# Altium schematic sheet Sheet1.SchDoc
size A0
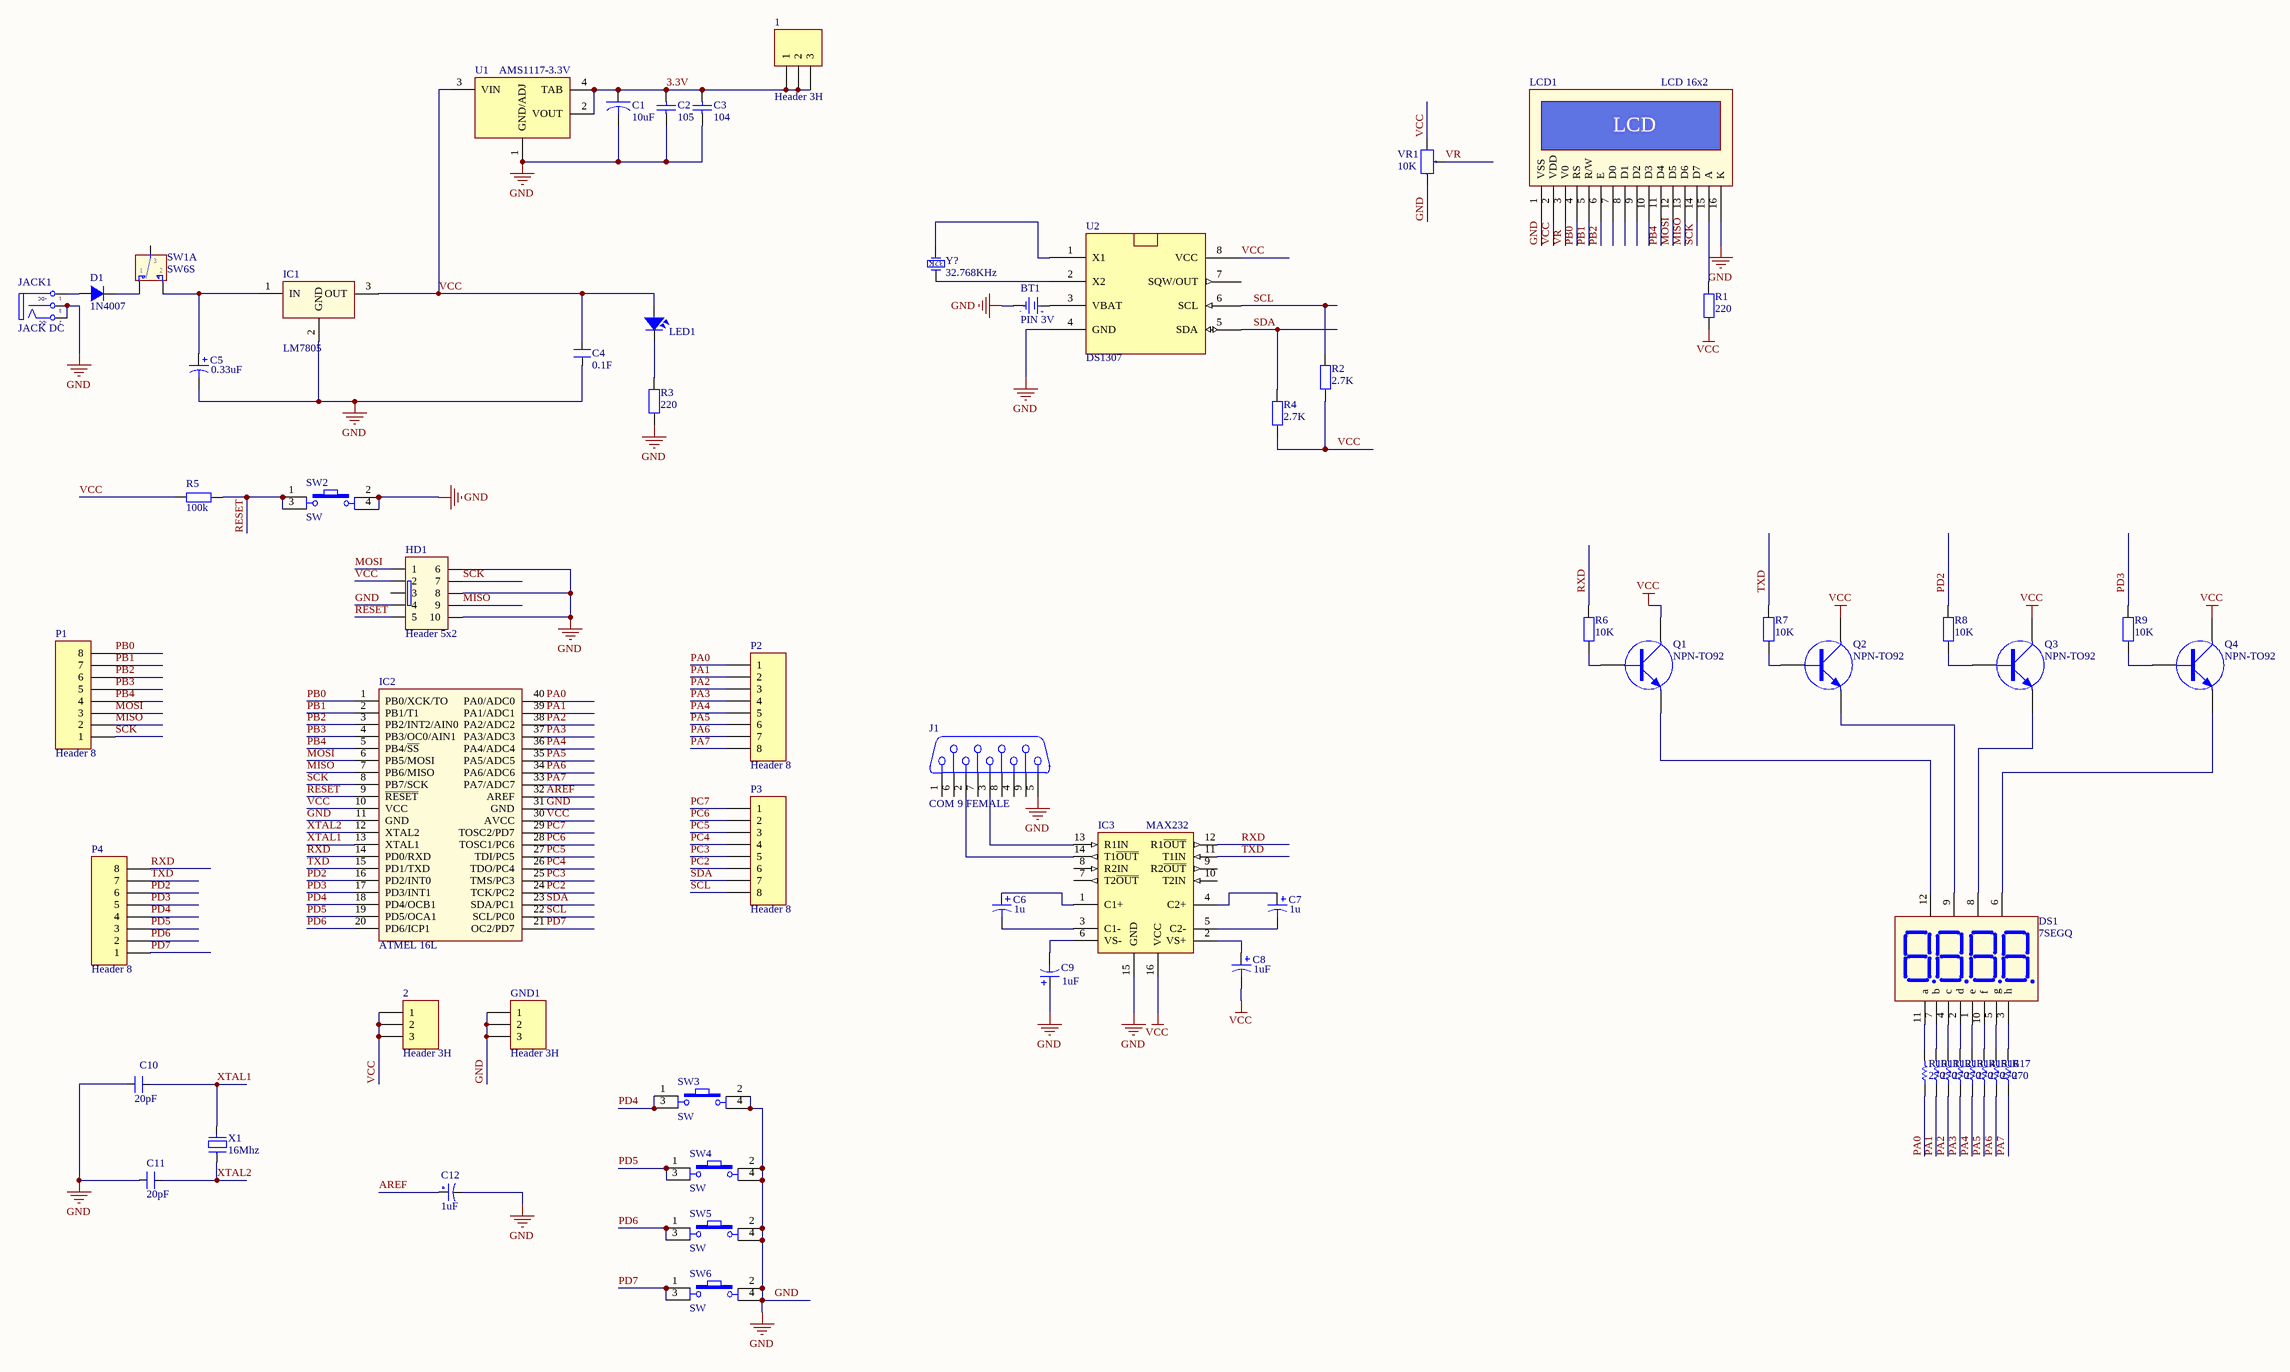
[diagram p0: Sheet1.SchDoc]

## Parts
1  Header 3H  [HDR1X3]
2  Header 3H  [HDR1X3]
BT1  PIN 3V  [PIN3V]
C1  10uF  [CAP RADIAL 3.5x7.7]
C2  105  [CAP 10x DIP]
C3  104  [CAP 10x DIP]
C4  0.1F  [CN3]
C5  value 0.33uF  [CAP RADIAL 3.5x7.7]
C6  value 1u  [CAP RADIAL 3.5x7.7]
C7  value 1u  [CAP RADIAL 3.5x7.7]
C8  value 1uF  [CAP RADIAL 3.5x7.7]
C9  value 1uF  [CAP RADIAL 3.5x7.7]
C10  20pF  [CN1]
C11  20pF  [CN1]
C12  1uF  [CP1/2]
D1  1N4007  [D1A]
DS1  7SEGQ  [7SEGQ]
GND1  Header 3H  [HDR1X3]
HD1  Header 5x2  [Hed2X5]
IC1  LM7805  [QTO-220H3]
IC2  ATMEL 16L  [DIP40/W0.6]
IC3  MAX232  [DIP16/W0.3]
J1  COM 9 FEMALE  [COM9 FEMALE]
JACK1  JACK DC  [JACK DC]
LCD1  LCD 16x2  [LCD 16x2-A]
LED1  LED  [LED-5-Green]  (value not drawn)
P1  Header 8  [HDR1X8]
P2  Header 8  [HDR1X8]
P3  Header 8  [HDR1X8]
P4  Header 8  [HDR1X8]
Q1  NPN-TO92  [TO-92]
Q2  NPN-TO92  [TO-92]
Q3  NPN-TO92  [TO-92]
Q4  NPN-TO92  [TO-92]
R1  220  [R1/4W]
R2  2.7K  [R1/4W]
R3  220  [R1/4W]
R4  2.7K  [R1/4W]
R5  100k  [RESISTOR]
R6  10K  [R1/4W]
R7  10K  [R1/4W]
R8  10K  [R1/4W]
R9  10K  [R1/4W]
R10  value 270  [R1/4W1]  (hidden comment: Res1)
R11  value 270  [R1/4W1]  (hidden comment: Res1)
R12  value 270  [R1/4W1]  (hidden comment: Res1)
R13  value 270  [R1/4W1]  (hidden comment: Res1)
R14  value 270  [R1/4W1]  (hidden comment: Res1)
R15  value 270  [R1/4W1]  (hidden comment: Res1)
R16  value 270  [R1/4W1]  (hidden comment: Res1)
R17  value 270  [R1/4W1]  (hidden comment: Res1)
SW1  SW6S  [SW6]  (part A of 2)
SW2  SW  [SW4]
SW3  SW  [SW4]
SW4  SW  [SW4]
SW5  SW  [SW4]
SW6  SW  [SW4]
U1  AMS1117-3.3V  [SOT223 - 3 LEAD]
U2  DS1307  [DIP8/W0.3]
VR1  10K  [VR]
X1  16Mhz  [XT2]
Y?  32.768KHz  [XTAL32K]

## Nets
GND: BT1.2(GND) C1.2 C2.1 C3.1 C4.2 C5.2 C9.1 C10.2 C11.2 C12.2 GND1.1 GND1.2 GND1.3 HD1.4 HD1.6 HD1.8 HD1.10 IC1.2(GND) IC2.11(GND) IC2.31(GND) IC3.15(GND) J1.5 JACK1.2(TN) JACK1.3(S) LCD1.1(VSS) LCD1.16(K) R3.1 SW2.2 SW2.4 SW3.2 SW3.4 SW4.2 SW4.4 SW5.2 SW5.4 SW6.2 SW6.4 U1.1(GND/ADJ) U2.4(GND) VR1.3 Y?.0
VCC: 2.1 2.2 2.3 C4.1 C8.2 HD1.2 IC1.3(OUT) IC2.10(VCC) IC2.30(AVCC) IC3.16(VCC) LCD1.2(VDD) LED1.1 Q1.2(C) Q2.2(C) Q3.2(C) Q4.2(C) R1.1 R2.1 R4.1 R5.1 U1.3(VIN) U2.8(VCC) VR1.1
3.3V: 1.1 1.2 1.3 C1.1 C2.2 C3.2 U1.2(VOUT) U1.4(TAB)
AREF: C12.1 IC2.32(AREF)
MISO: HD1.9 IC2.7(PB6/MISO) LCD1.13(D6) P1.2
MOSI: HD1.1 IC2.6(PB5/MOSI) LCD1.12(D5) P1.3
PA0: IC2.40(PA0/ADC0) P2.1 R10.1
PA1: IC2.39(PA1/ADC1) P2.2 R11.1
PA2: IC2.38(PA2/ADC2) P2.3 R12.1
PA3: IC2.37(PA3/ADC3) P2.4 R13.1
PA4: IC2.36(PA4/ADC4) P2.5 R14.1
PA5: IC2.35(PA5/ADC5) P2.6 R15.1
PA6: IC2.34(PA6/ADC6) P2.7 R16.1
PA7: IC2.33(PA7/ADC7) P2.8 R17.1
PB0: IC2.1(PB0/XCK/TO) LCD1.4(RS) P1.8
PB1: IC2.2(PB1/T1) LCD1.5(R/W) P1.7
PB2: IC2.3(PB2/INT2/AIN0) LCD1.6(E) P1.6
PB3: IC2.4(PB3/OC0/AIN1) P1.5
PB4: IC2.5(PB4/~{SS}) LCD1.11(D4) P1.4
PC2: IC2.24(TCK/PC2) P3.6
PC3: IC2.25(TMS/PC3) P3.5
PC4: IC2.26(TDO/PC4) P3.4
PC5: IC2.27(TDI/PC5) P3.3
PC6: IC2.28(TOSC1/PC6) P3.2
PC7: IC2.29(TOSC2/PD7) P3.1
PD2: IC2.16(PD2/INT0) P4.6 R8.2
PD3: IC2.17(PD3/INT1) P4.5 R9.2
PD4: IC2.18(PD4/OCB1) P4.4 SW3.1 SW3.3
PD5: IC2.19(PD5/OCA1) P4.3 SW4.1 SW4.3
PD6: IC2.20(PD6/ICP1) P4.2 SW5.1 SW5.3
PD7: IC2.21(OC2/PD7) P4.1 SW6.1 SW6.3
RESET: HD1.5 IC2.9(~{RESET}) R5.2 SW2.1 SW2.3
RXD: IC2.14(PD0/RXD) IC3.12(R1~{OUT}) P4.8 R6.2
SCK: HD1.7 IC2.8(PB7/SCK) LCD1.14(D7) P1.1
SCL: IC2.22(SCL/PC0) P3.8 R2.2 U2.6(SCL)
SDA: IC2.23(SDA/PC1) P3.7 R4.2 U2.5(SDA)
TXD: IC2.15(PD1/TXD) IC3.11(T1IN) P4.7 R7.2
VR: LCD1.3(V0) VR1.2
XTAL1: C10.1 IC2.13(XTAL1) X1.2
XTAL2: C11.1 IC2.12(XTAL2) X1.1
NetBT1_1: BT1.1(+3V) U2.3(VBAT)
NetC5_1: C5.1 IC1.1(IN) SW1.2
NetC6_1: C6.1 IC3.1(C1+)
NetC6_2: C6.2 IC3.3(C1-)
NetC7_1: C7.1 IC3.4(C2+)
NetC7_2: C7.2 IC3.5(C2-)
NetC8_1: C8.1 IC3.2(VS+)
NetC9_2: C9.2 IC3.6(VS-)
NetD1_1: D1.1(A) JACK1.1(T)
NetD1_2: D1.2(K) SW1.1
NetDS1_1: DS1.1(e) R14.2
NetDS1_2: DS1.2(d) R13.2
NetDS1_3: DS1.3(h) R17.2
NetDS1_4: DS1.4(c) R12.2
NetDS1_5: DS1.5(g) R16.2
NetDS1_6: DS1.6(V4) Q4.1(E)
NetDS1_7: DS1.7(b) R11.2
NetDS1_8: DS1.8(V3) Q3.1(E)
NetDS1_9: DS1.9(V2) Q2.1(E)
NetDS1_10: DS1.10(f) R15.2
NetDS1_11: DS1.11(a) R10.2
NetDS1_12: DS1.12(V1) Q1.1(E)
NetIC3_13: IC3.13(R1IN) J1.3
NetIC3_14: IC3.14(T1~{OUT}) J1.2
NetLCD1_15: LCD1.15(A) R1.2
NetLED1_2: LED1.2 R3.2
NetQ1_3: Q1.3(B) R6.1
NetQ2_3: Q2.3(B) R7.1
NetQ3_3: Q3.3(B) R8.1
NetQ4_3: Q4.3(B) R9.1
NetU2_1: U2.1(X1) Y?.2(OSC2)
NetU2_2: U2.2(X2) Y?.1(OSC1)

Not connected (* = marked no-connect by the designer): HD1 3; IC3 7(T2~{OUT}) 8(R2IN) 9(R2~{OUT}) 10(T2IN); J1 1 4 6 7 8 9; LCD1 7(D0) 8(D1) 9(D2) 10(D3); SW1 3; U2 7(SQW/OUT)

## Notes on the sheet
- (in symbol JACK DC) +DC; -DC
- (in symbol LCD 16x2) LCD
- (in symbol PIN 3V) -; +
- (in symbol XTAL/32KHz) 32K

## Library data of the parts
BT1 = PIN 3V: Battery 3VDC; Value: PIN 3V
C1 = CAPACITOR
C2 C3 = CAP CERAMIC: Published: 8-Jun-2000; LatestRevisionDate: 17-Jul-2002; LatestRevisionNote: Re-released for DXP Platform.; PackageReference: RAD-0.3; Publisher: Altium Limited
C4 = CN3: Cap np W0.3; Value: 0,047uF; Copyright: VanDungEvn
C5-C9 = Cap Pol3: Polarized Capacitor (Surface Mount); VALUE: C?; LatestRevisionDate: 17-Jul-2002; LatestRevisionNote: Re-released for DXP Platform.; PackageReference: C0805; Publisher: Altium Limited
C10 C11 = CN1: Cap np  1pF - 472pF; Value: 100pF
C12 = CP1: Cap P  0,1uF < 22uF , 16 - 50V; Value: 10uF/50V; Description 1: 10 => 220uF/6,3V/10V - 10uF => 100uF/16V; Description 2: 0,1uF => 33uF/50V - 10uF => 22uF/63V; Description 3: 0,47uF => 10uF/100V
D1 = D1A: Diode 1A; Value: 1N4007
DS1 = LED7Q: Four 7 Seg Dipslay; Value: LED 7Q SEG
HD1 = HED5x2: Value: Header 5x2
IC1 = LM78xx: On ap +, from + 5 to + 24VDC; Value: LM7805
IC2 = Atmega16L: 8-Bit AVR Microcontroller with 16K Bytes of In-System Programmable Flash Memory; Value: Atmega 16L
IC3 = MAX232: Dual EIA-232 Driver/Receiver; Value: MAX232
J1 = COM 9 FEMALE: PackageDocument: O; Positions: 9; Gender: Receptacle; Published: 15-Jun-2001; LatestRevisionDate: 17-Jul-2002; LatestRevisionNote: Re-released for DXP Platform.; DatasheetDocument: 1-Sep-1999; PackageReference: 788750; Publisher: Altium Limited; Orientation: Right Angle
JACK1 = JACK DC: Value: Jac DC
LED1 = LED: LED Single colour Green and Red; Value: LED 3 ly Single Colour
R1-R4 R6-R9 = R1/4W: Resistor 1/4W; Value: R1/4W - 1K
R5 = RESISTOR: Value: R1/4W - 1K
R10-R17 = Res1_2: Resistor; Manufacturer: Generic Components; Class: Passive; Published: 08/06/2000; Publisher: Altium Hobart Technology Centre; SubClass: Resistor
SW1 = SW6S: SW-DTDP - 6 Pin; Value: SW6
SW2-SW6 = SW4: Switch button 4 pin; Value: Button chip 4 pin
U1 = AMS1117
VR1 = VAR RES: Value: VR 10K
X1 = XT2: Crystal For all Crystal 2pin.; Value: 4Mhz
Y? = XTAL/32KHz: Crystal Oscillator; Published: 8-Jun-2000; LatestRevisionDate: 17-Jul-2002; LatestRevisionNote: Re-released for DXP Platform.; PackageReference: R38; Publisher: Altium Limited
1 2 GND1 = Header 3H: LatestRevisionDate: 17-Jul-2002; LatestRevisionNote: Re-released for DXP Platform.; Publisher: Altium Limited
P1-P4 = Header 8: LatestRevisionDate: 17-Jul-2002; LatestRevisionNote: Re-released for DXP Platform.; Publisher: Altium Limited